# Altium schematic sheet Analog_Circuit_1.SchDoc
size A4; SheetNumber: 4; SheetTotal: 4
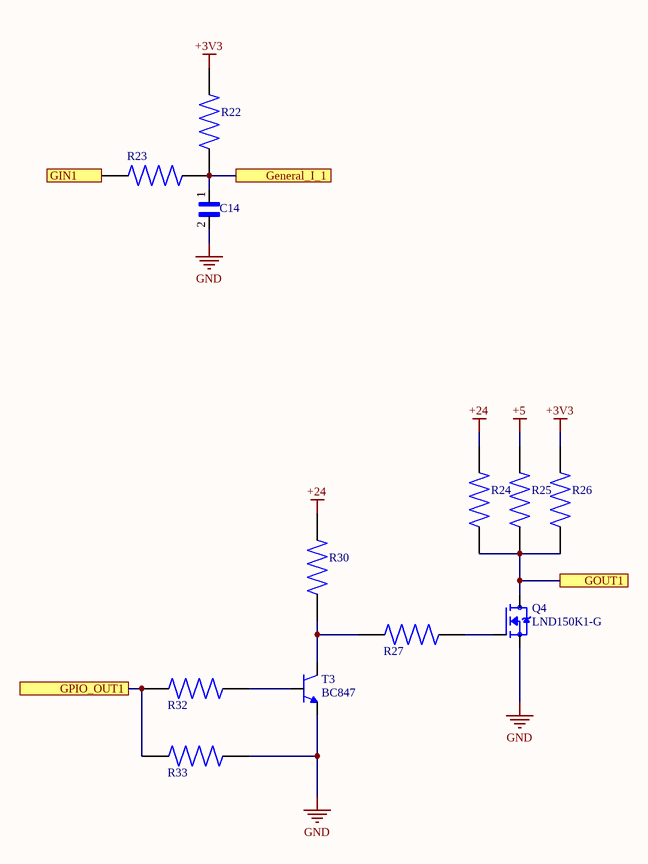
[diagram p0: Analog_Circuit_1.SchDoc]

## Parts
C14  0805_Capacitor  [0805_Capacitor]  (value not drawn)
Q4  LND150K1-G  [SOT93-NMOS]
R22  0805_Resistor  [0805_Resistor]  (value not drawn)
R23  0805_Resistor  [0805_Resistor]  (value not drawn)
R24  0805_Resistor  [0805_Resistor]  (value not drawn)
R25  0805_Resistor  [0805_Resistor]  (value not drawn)
R26  0805_Resistor  [0805_Resistor]  (value not drawn)
R27  0805_Resistor  [0805_Resistor]  (value not drawn)
R30  0805_Resistor  [0805_Resistor]  (value not drawn)
R32  0805_Resistor  [0805_Resistor]  (value not drawn)
R33  0805_Resistor  [0805_Resistor]  (value not drawn)
T3  BC847  [SOT23]

## Ports
General_I_1 (see Dynamics_Sch[6C]), GIN1 (see Dynamics_Sch[2B]), GOUT1 (see Dynamics_Sch[2B]), GPIO_OUT1 (see Dynamics_Sch[6C])

## Nets
+3V3: R22.2 R26.1
+5: R25.1
+24: R24.1 R30.2
GND: C14.2 Q4.3(S) R33.1 T3.2(E)
General_I_1: C14.1 R22.1 R23.2 ; port General_I_1
GIN1: R23.1 ; port GIN1
GOUT1: Q4.2(D) R24.2 R25.2 R26.2 ; port GOUT1
GPIO_OUT1: R32.2 R33.2 ; port GPIO_OUT1
NetQ4_1: Q4.1(G) R27.1
NetR27_2: R27.2 R30.1 T3.3(C)
NetR32_1: R32.1 T3.1(B)

## Library data of the parts
C14 = 0805_Capacitor: MP: CL21B104KBCNNNC; MF: Samsung; Availability: Unavailable; Package: 0805 Samsung; Value: *; Price: None; SnapEDA_Link: https://www.snapeda.com/parts/CL21B104KBCNNNC/Samsung/view-part/3597943/?ref=snap
Q4 = LND150K1-G: MOSFET, DEPLETION-MODE, 500V, 1K Ohm3 SOT-23 T/R | Microchip Technology Inc. LND150K1-G; SnapEDA_Link: https://www.snapeda.com/parts/LND150K1-G/Microchip/view-part/?ref=snap; Package: SOT-23 Microchip; Value: *; MF: Microchip; MP: LND150K1-G; Check_prices: https://www.snapeda.com/parts/LND150K1-G/Microchip/view-part/?ref=eda
R22-R27 R30 R32 R33 = 0805_Resistor: MF: Yageo; MP: RC0805FR-07910RL; Package: 2012 Rohm Semiconductor; Value: *; Purchase-URL: https://pricing.snapeda.com/search/part/RC0805FR-07910RL/?ref=eda; Availability: In Stock; Price: None
T3 = BC847: <b>NPN TRANSISTOR</b>; Availability: Unavailable; Package: None; MP: BC847; Value: *; Price: None